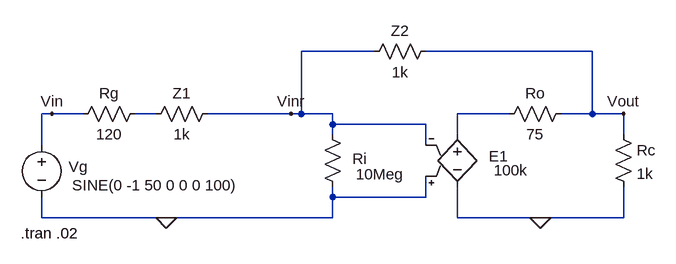
[diagram p0: schematic CE1_1.asc]
CE1_1.asc, the LTspice schematic file:
Version 4
SHEET 1 992 1008
WIRE 480 16 368 16
WIRE 816 16 560 16
WIRE -16 112 -32 112
WIRE 32 112 -16 112
WIRE 144 112 112 112
WIRE 352 112 224 112
WIRE 368 112 368 16
WIRE 368 112 352 112
WIRE 416 112 368 112
WIRE 688 112 608 112
WIRE 816 112 816 16
WIRE 816 112 768 112
WIRE 864 112 816 112
WIRE 416 128 416 112
WIRE 560 128 416 128
WIRE 416 144 416 128
WIRE 608 144 608 112
WIRE 864 144 864 112
WIRE -32 160 -32 112
WIRE 560 160 560 128
WIRE 416 240 416 224
WIRE 560 240 560 208
WIRE 560 240 416 240
WIRE -32 272 -32 240
WIRE 160 272 -32 272
WIRE 416 272 416 240
WIRE 416 272 160 272
WIRE 608 272 608 224
WIRE 736 272 608 272
WIRE 864 272 864 224
WIRE 864 272 736 272
FLAG 736 272 0
FLAG 864 112 Vout
FLAG -16 112 Vin
FLAG 160 272 0
FLAG 352 112 Vinr
SYMBOL voltage -32 144 R0
WINDOW 0 42 49 Left 2
WINDOW 3 47 78 Left 2
WINDOW 123 0 0 Left 0
WINDOW 39 0 0 Left 0
SYMATTR InstName Vg
SYMATTR Value SINE(0 -1 50 0 0 0 100)
SYMBOL res 128 96 R90
WINDOW 0 0 56 VBottom 2
WINDOW 3 32 56 VTop 2
SYMATTR InstName Rg
SYMATTR Value 120
SYMBOL res 128 128 R270
WINDOW 0 32 56 VTop 2
WINDOW 3 0 56 VBottom 2
SYMATTR InstName Z1
SYMATTR Value 1k
SYMBOL res 464 32 R270
WINDOW 0 32 56 VTop 2
WINDOW 3 0 56 VBottom 2
SYMATTR InstName Z2
SYMATTR Value 1k
SYMBOL res 400 128 R0
WINDOW 0 47 53 Left 2
WINDOW 3 52 77 Left 2
SYMATTR InstName Ri
SYMATTR Value 10Meg
SYMBOL res 784 96 R90
WINDOW 0 0 56 VBottom 2
WINDOW 3 32 56 VTop 2
SYMATTR InstName Ro
SYMATTR Value 75
SYMBOL res 848 128 R0
SYMATTR InstName Rc
SYMATTR Value 1k
SYMBOL e2 608 128 R0
WINDOW 0 49 49 Left 2
WINDOW 3 56 71 Left 2
SYMATTR InstName E1
SYMATTR Value 100k
TEXT -64 296 Left 2 !.tran .02

The netlist it stands for:
* CE1_1.asc
Vg Vin 0 SINE(0 -1 50 0 0 0 100)
Rg N001 Vin 120
R§Z1 N001 Vinr 1k
R§Z2 Vinr Vout 1k
Ri Vinr 0 10Meg
Ro Vout N002 75
Rc Vout 0 1k
E1 N002 0 0 Vinr 100k
.tran .02
.backanno
.end

* Results of the author's LTspice run, read from the files saved beside the schematic
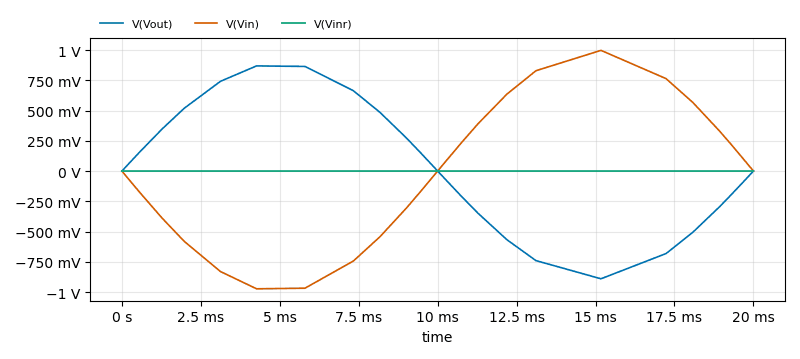
[diagram p1: Transient Analysis of CE1_1.asc, plotted from the saved traces]
* Transient Analysis, 1 run:
*   V(Vout): min -890.6 mV, max 869.1 mV, average 3.018 mV, rms 622 mV, last 0 V
*   V(Vin): min -973.4 mV, max 997.5 mV, average -3.38 mV, rms 696.6 mV, last 0 V
*   V(Vinr): min -9.994 µV, max 10.24 µV, average -34.7 nV, rms 7.153 µV, last 0 V